# Altium schematic sheet scale_schematic.SchDoc
size A4; SheetNumber: 1; SheetTotal: 1
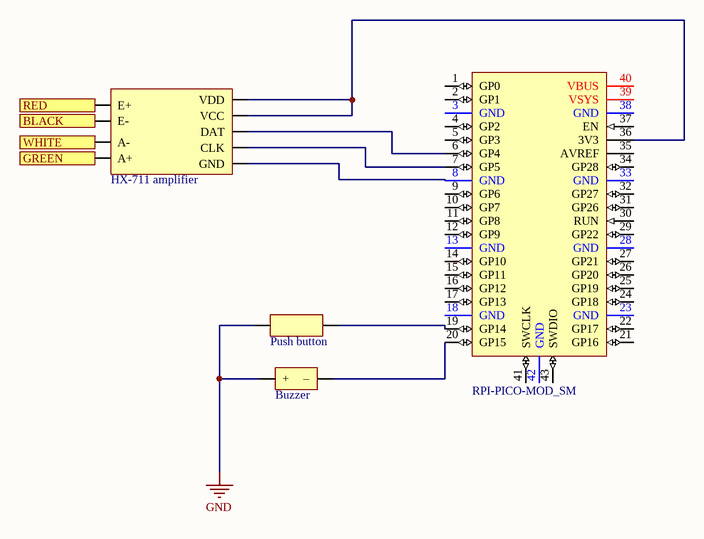
[diagram p0: scale_schematic.SchDoc]

## Parts
(Parts that share a designator on the sheet are numbered #1, #2 ... from top to bottom, then left to right.)
*#1  HX-711 amplifier
*#2  Push button
*#3  Buzzer
U?  RPI-PICO-MOD_SM  [RPI-PICO-MOD]

## Ports
BLACK, GREEN, RED, WHITE

## Nets
GND: *#2.5 *#3.8(+)
BLACK: *#1.3(E-) ; port BLACK
GREEN: *#1.3(A+) ; port GREEN
RED: *#1.2(E+) ; port RED
WHITE: *#1.3(A-) ; port WHITE
Net*#1_1: *#1.1(DAT) U?.6(GP4)
Net*#1_1: *#1.1(CLK) U?.7(GP5)  [a separate net that carries the same name]
Net*#1_1: *#1.1(GND) U?.8(GND)  [a separate net that carries the same name]
Net*#1_1: *#1.1(VDD) U?.36(3V3)  [a separate net that carries the same name]
Net*#2_6: *#2.6 U?.19(GP14)
Net*#3_7: *#3.7(–) U?.20(GP15)

Not connected (* = marked no-connect by the designer): U? 1(GP0) 2(GP1) 3(GND) 4(GP2) 5(GP3) 9(GP6) 10(GP7) 11(GP8) 12(GP9) 13(GND) 14(GP10) 15(GP11) 16(GP12) 17(GP13) 18(GND) 21(GP16) 22(GP17) 23(GND) 24(GP18) 25(GP19) 26(GP20) 27(GP21) 28(GND) 29(GP22) 30(RUN) 31(GP26) 32(GP27) 33(GND) 34(GP28) 35(AVREF) 37(EN) 38(GND) 39(VSYS) 40(VBUS) 41(SWCLK) 42(GND) 43(SWDIO)

## Library data of the parts
U? = RPI-PICO-MOD_SM: RASPBERRY PI PICO RP2040 BOARD NO TEST PADS; Manufacturer: Raspberry Pi Foundation; Manufacturer Part No: SC0915; Mounting Technology: SMT; Supplier: DigiKey; Supplier Part No: 2648-SC0915CT-ND; Supplier Link: https://www.digikey.com/en/products/detail/raspberry-pi/SC0915/13684020